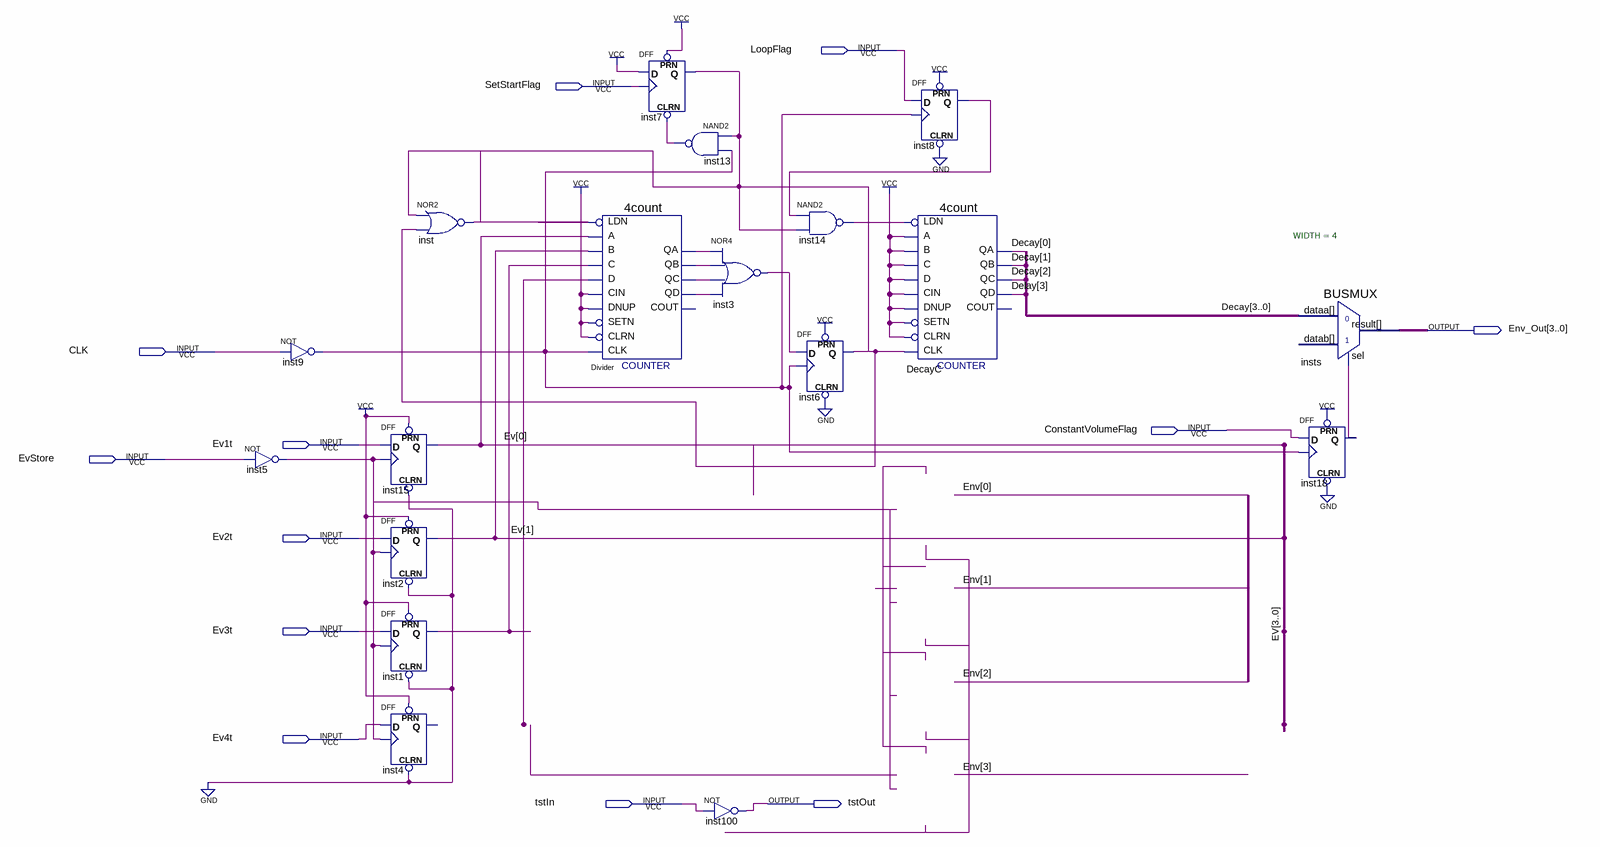
[diagram p0: schematic sheet]
// Quartus schematic Envelope.bdf as structural Verilog: 18 symbols, 12 pins
module Envelope (
  input  LoopFlag,
  input  SetStartFlag,
  input  CLK,
  input  ConstantVolumeFlag,
  input  Ev1t,
  input  EvStore,
  input  Ev2t,
  input  Ev3t,
  input  Ev4t,
  input  tstIn,
  output [3:0] Env_Out,
  output tstOut
);

  wire Divider_qa, Divider_qb, Divider_qc, Divider_qd, inst1_q, inst3_out, inst5_out, inst7_q, inst8_q,
       inst9_out, inst13_out, inst14_out, inst18_q, inst_out, undriven;
  wire [1:0] EV;
  wire [3:0] Decay;
  wire [3:3] Delay;

  not inst9 (inst9_out, CLK);
  not inst5 (inst5_out, EvStore);
  DFF inst15 (.CLRN(1'b0), .CLK(inst5_out), .D(Ev1t), .PRN(1'b1), .Q(EV[0]));
  DFF inst2 (.CLRN(1'b0), .CLK(inst5_out), .D(Ev2t), .PRN(1'b1), .Q(EV[1]));
  DFF inst1 (.CLRN(1'b0), .CLK(inst5_out), .D(Ev3t), .PRN(1'b1), .Q(inst1_q));
  DFF inst4 (.CLRN(1'b0), .CLK(inst5_out), .D(Ev4t), .PRN(1'b1));  // open: Q
  nor inst (inst_out, inst7_q, inst7_q);
  \4count  Divider (
    .LDN(inst_out), .B(EV[1]), .A(EV[0]), .D(undriven), .CIN(1'b1), .DNUP(1'b1), .CLK(inst9_out),
    .SETN(1'b1), .C(inst1_q), .CLRN(1'b1), .QA(Divider_qa), .QB(Divider_qb), .QC(Divider_qc), .QD(Divider_qd));  // open: COUT
  DFF inst7 (.CLRN(inst13_out), .CLK(SetStartFlag), .D(1'b1), .PRN(1'b1), .Q(inst7_q));
  nand inst13 (inst13_out, inst7_q, inst9_out);
  nor inst3 (inst3_out, Divider_qa, Divider_qb, Divider_qc, Divider_qd);
  not inst100 (tstOut, tstIn);
  nand inst14 (inst14_out, inst8_q, inst7_q);
  DFF inst6 (.CLRN(1'b0), .CLK(inst9_out), .D(inst3_out), .PRN(1'b1), .Q(inst7_q));
  DFF inst8 (.CLRN(1'b0), .CLK(inst9_out), .D(LoopFlag), .PRN(1'b1), .Q(inst8_q));
  \4count  DecayC (
    .LDN(inst14_out), .B(1'b1), .A(1'b1), .D(1'b1), .CIN(1'b1), .DNUP(1'b1), .CLK(inst7_q), .SETN(1'b1),
    .C(1'b1), .CLRN(1'b1), .QA(Decay[0]), .QB(Decay[1]), .QC(Decay[2]), .QD(Delay[3]));  // open: COUT
  BUSMUX #(.WIDTH(4)) insts (.sel(inst18_q), .dataa(Decay), .result(Env_Out));  // open: datab
  DFF inst18 (.CLRN(1'b0), .CLK(inst9_out), .D(ConstantVolumeFlag), .PRN(1'b1), .Q(inst18_q));
endmodule
